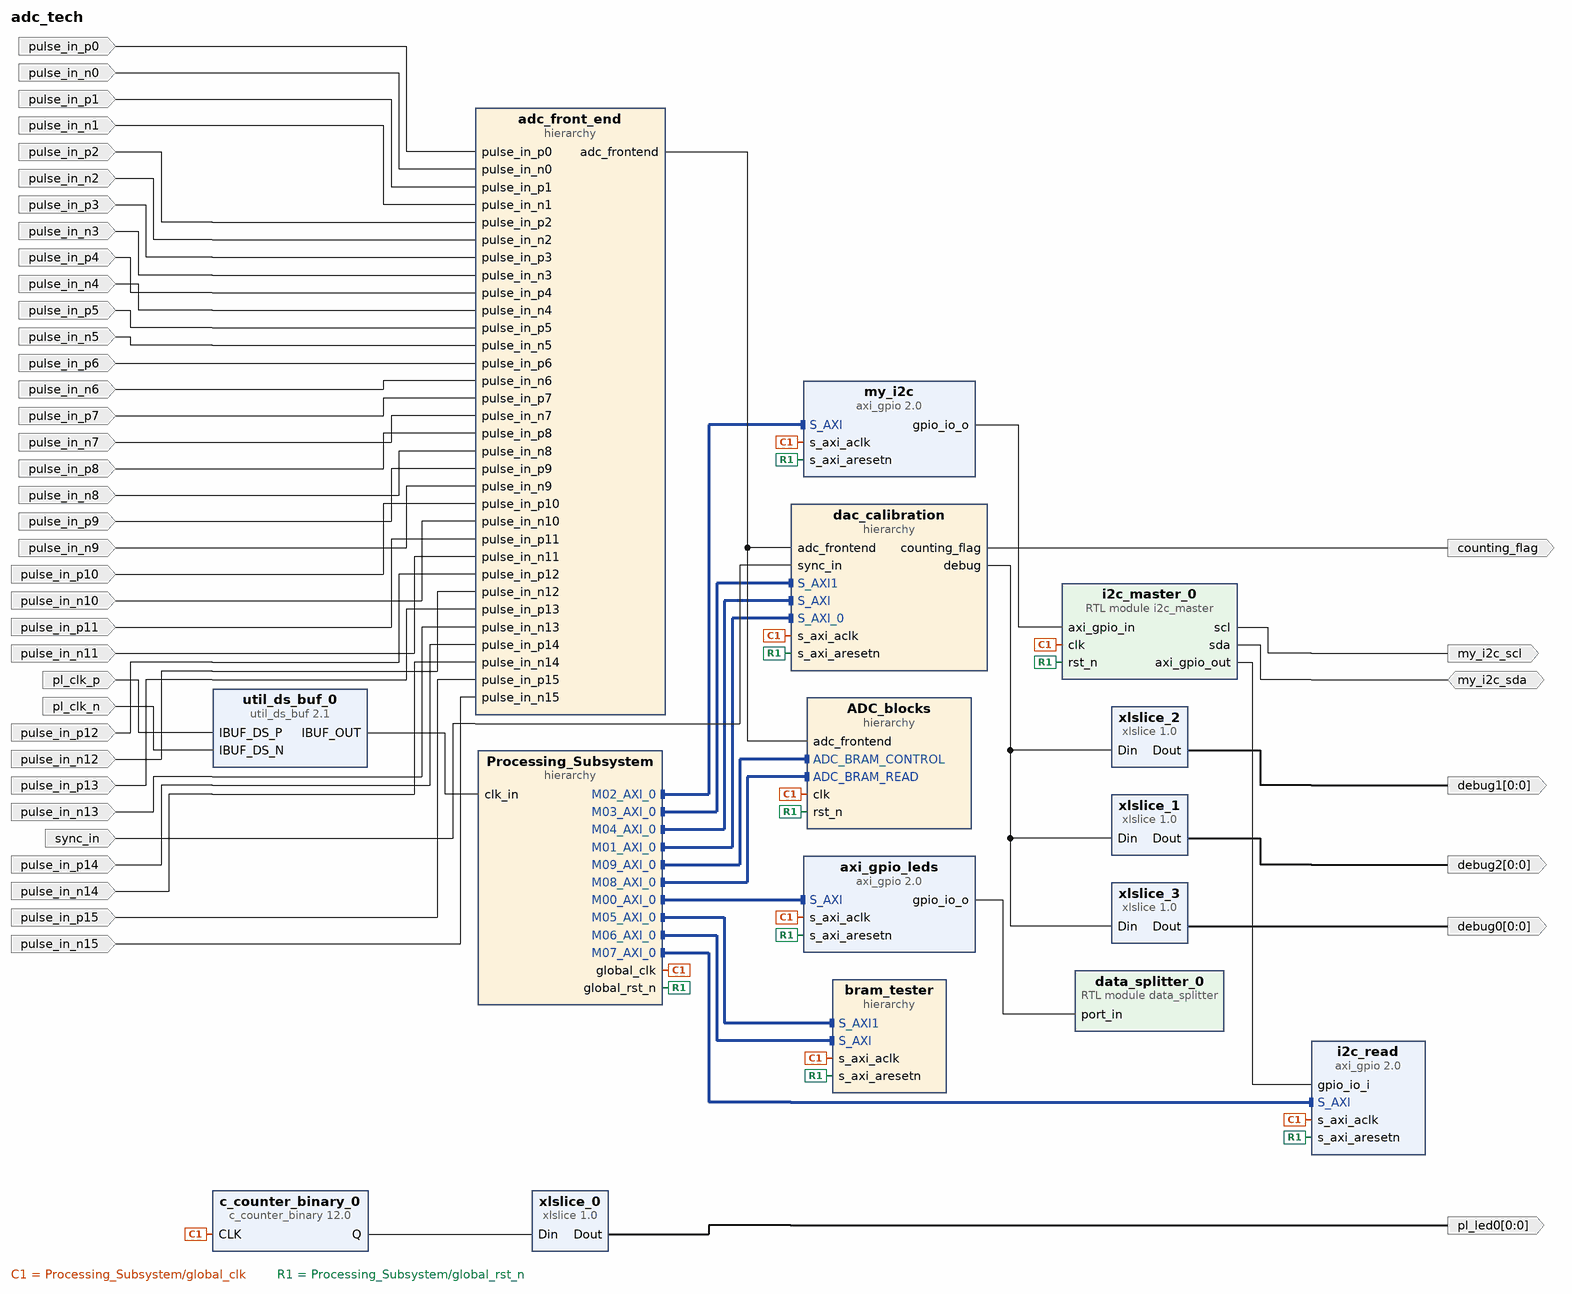
[diagram p0: block diagram of the top level]
# Vivado block design adc_tech, xczu7ev-ffvc1156-2-e, Vivado 2020.2
create_bd_design adc_tech

create_bd_port -dir I -type clk pl_clk_p
set_property -dict {CONFIG.FREQ_HZ 125000000} [get_bd_ports pl_clk_p]
create_bd_port -dir O -from 0 -to 0 pl_led0
create_bd_port -dir I -type clk pl_clk_n
set_property -dict {CONFIG.FREQ_HZ 125000000} [get_bd_ports pl_clk_n]
create_bd_port -dir O my_i2c_scl
create_bd_port -dir IO my_i2c_sda
create_bd_port -dir I pulse_in_p0
create_bd_port -dir I sync_in
create_bd_port -dir O counting_flag
create_bd_port -dir I pulse_in_n0
create_bd_port -dir I pulse_in_n1
create_bd_port -dir I pulse_in_p1
create_bd_port -dir I pulse_in_p2
create_bd_port -dir I pulse_in_n2
create_bd_port -dir I pulse_in_p3
create_bd_port -dir I pulse_in_n3
create_bd_port -dir O -from 0 -to 0 debug0
create_bd_port -dir O -from 0 -to 0 debug1
create_bd_port -dir O -from 0 -to 0 debug2
create_bd_port -dir I pulse_in_p4
create_bd_port -dir I pulse_in_n4
create_bd_port -dir I pulse_in_p5
create_bd_port -dir I pulse_in_n5
create_bd_port -dir I pulse_in_p6
create_bd_port -dir I pulse_in_n6
create_bd_port -dir I pulse_in_p7
create_bd_port -dir I pulse_in_n7
create_bd_port -dir I pulse_in_p8
create_bd_port -dir I pulse_in_n8
create_bd_port -dir I pulse_in_p9
create_bd_port -dir I pulse_in_n9
create_bd_port -dir I pulse_in_p10
create_bd_port -dir I pulse_in_n10
create_bd_port -dir I pulse_in_p11
create_bd_port -dir I pulse_in_n11
create_bd_port -dir I pulse_in_p12
create_bd_port -dir I pulse_in_n12
create_bd_port -dir I pulse_in_p13
create_bd_port -dir I pulse_in_n13
create_bd_port -dir I pulse_in_p14
create_bd_port -dir I pulse_in_n14
create_bd_port -dir I pulse_in_p15
create_bd_port -dir I pulse_in_n15

create_bd_cell -type hier Processing_Subsystem
create_bd_cell -type ip -vlnv xilinx.com:ip:util_ds_buf:2.1 util_ds_buf_0
create_bd_cell -type ip -vlnv xilinx.com:ip:axi_gpio:2.0 axi_gpio_leds
set_property -dict {CONFIG.C_ALL_OUTPUTS 1} [get_bd_cells axi_gpio_leds]
create_bd_cell -type ip -vlnv xilinx.com:ip:axi_gpio:2.0 my_i2c
set_property -dict {CONFIG.C_ALL_OUTPUTS 1} [get_bd_cells my_i2c]
create_bd_cell -type module -reference data_splitter data_splitter_0
create_bd_cell -type ip -vlnv xilinx.com:ip:c_counter_binary:12.0 c_counter_binary_0
set_property -dict {CONFIG.Output_Width 32} [get_bd_cells c_counter_binary_0]
create_bd_cell -type ip -vlnv xilinx.com:ip:xlslice:1.0 xlslice_0
set_property -dict {CONFIG.DIN_FROM 27 CONFIG.DIN_TO 27 CONFIG.DOUT_WIDTH 1} [get_bd_cells xlslice_0]
create_bd_cell -type ip -vlnv xilinx.com:ip:xlslice:1.0 xlslice_1
set_property -dict {CONFIG.DIN_FROM 2 CONFIG.DIN_TO 2 CONFIG.DIN_WIDTH 3 CONFIG.DOUT_WIDTH 1} [get_bd_cells xlslice_1]
create_bd_cell -type ip -vlnv xilinx.com:ip:xlslice:1.0 xlslice_2
set_property -dict {CONFIG.DIN_FROM 1 CONFIG.DIN_TO 1 CONFIG.DIN_WIDTH 3 CONFIG.DOUT_WIDTH 1} [get_bd_cells xlslice_2]
create_bd_cell -type ip -vlnv xilinx.com:ip:xlslice:1.0 xlslice_3
set_property -dict {CONFIG.DIN_WIDTH 3} [get_bd_cells xlslice_3]
create_bd_cell -type hier bram_tester
create_bd_cell -type hier dac_calibration
create_bd_cell -type hier adc_front_end
create_bd_cell -type ip -vlnv xilinx.com:ip:axi_gpio:2.0 i2c_read
set_property -dict {CONFIG.C_ALL_INPUTS 1} [get_bd_cells i2c_read]
create_bd_cell -type module -reference i2c_master i2c_master_0
create_bd_cell -type hier ADC_blocks

# ---- hierarchy /Processing_Subsystem ----
current_bd_instance /Processing_Subsystem
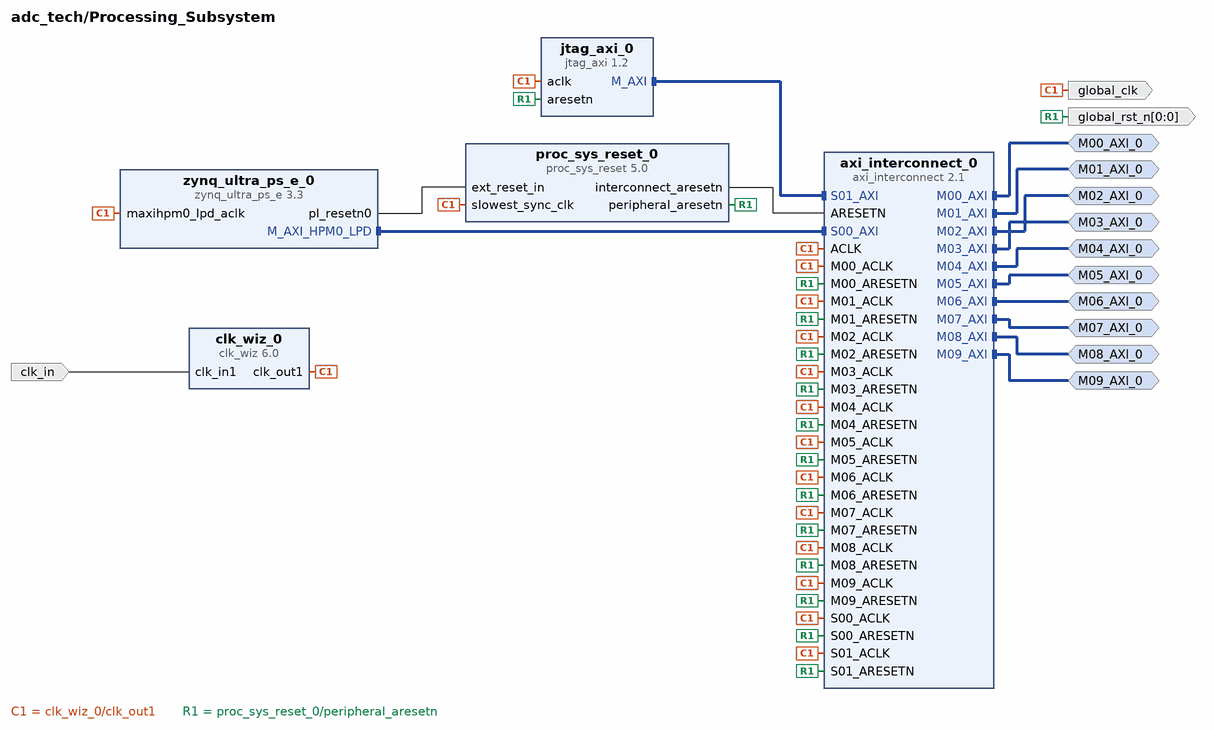
[diagram p1: block diagram inside /Processing_Subsystem]
create_bd_intf_pin -mode Master -vlnv xilinx.com:interface:aximm_rtl:1.0 M00_AXI_0
create_bd_intf_pin -mode Master -vlnv xilinx.com:interface:aximm_rtl:1.0 M01_AXI_0
create_bd_intf_pin -mode Master -vlnv xilinx.com:interface:aximm_rtl:1.0 M02_AXI_0
create_bd_intf_pin -mode Master -vlnv xilinx.com:interface:aximm_rtl:1.0 M03_AXI_0
create_bd_intf_pin -mode Master -vlnv xilinx.com:interface:aximm_rtl:1.0 M04_AXI_0
create_bd_intf_pin -mode Master -vlnv xilinx.com:interface:aximm_rtl:1.0 M05_AXI_0
create_bd_intf_pin -mode Master -vlnv xilinx.com:interface:aximm_rtl:1.0 M06_AXI_0
create_bd_intf_pin -mode Master -vlnv xilinx.com:interface:aximm_rtl:1.0 M07_AXI_0
create_bd_intf_pin -mode Master -vlnv xilinx.com:interface:aximm_rtl:1.0 M08_AXI_0
create_bd_intf_pin -mode Master -vlnv xilinx.com:interface:aximm_rtl:1.0 M09_AXI_0
create_bd_pin -dir I -type clk clk_in
create_bd_pin -dir O -from 0 -to 0 -type rst global_rst_n
create_bd_pin -dir O global_clk

create_bd_cell -type ip -vlnv xilinx.com:ip:axi_interconnect:2.1 axi_interconnect_0
set_property -dict {CONFIG.NUM_MI 10 CONFIG.NUM_SI 2} [get_bd_cells axi_interconnect_0]
create_bd_cell -type ip -vlnv xilinx.com:ip:clk_wiz:6.0 clk_wiz_0
set_property -dict [list \
  CONFIG.CLKIN1_JITTER_PS 80.0 \
  CONFIG.CLKOUT1_JITTER 146.303 \
  CONFIG.CLKOUT1_PHASE_ERROR 222.305 \
  CONFIG.CLKOUT1_REQUESTED_OUT_FREQ 400.000 \
  CONFIG.MMCM_CLKFBOUT_MULT_F 48.000 \
  CONFIG.MMCM_CLKIN1_PERIOD 8.000 \
  CONFIG.MMCM_CLKIN2_PERIOD 10.000 \
  CONFIG.MMCM_CLKOUT0_DIVIDE_F 3.000 \
  CONFIG.USE_RESET false \
] [get_bd_cells clk_wiz_0]
create_bd_cell -type ip -vlnv xilinx.com:ip:jtag_axi:1.2 jtag_axi_0
set_property -dict {CONFIG.RD_TXN_QUEUE_LENGTH 16 CONFIG.WR_TXN_QUEUE_LENGTH 16} [get_bd_cells jtag_axi_0]
create_bd_cell -type ip -vlnv xilinx.com:ip:proc_sys_reset:5.0 proc_sys_reset_0
create_bd_cell -type ip -vlnv xilinx.com:ip:zynq_ultra_ps_e:3.3 zynq_ultra_ps_e_0
set_property -dict [list \
  CONFIG.CAN0_BOARD_INTERFACE custom \
  CONFIG.CAN1_BOARD_INTERFACE custom \
  CONFIG.CSU_BOARD_INTERFACE custom \
  CONFIG.DP_BOARD_INTERFACE custom \
  CONFIG.GEM0_BOARD_INTERFACE custom \
  CONFIG.GEM1_BOARD_INTERFACE custom \
  CONFIG.GEM2_BOARD_INTERFACE custom \
  CONFIG.GEM3_BOARD_INTERFACE custom \
  CONFIG.GPIO_BOARD_INTERFACE custom \
  CONFIG.IIC0_BOARD_INTERFACE custom \
  CONFIG.IIC1_BOARD_INTERFACE custom \
  CONFIG.NAND_BOARD_INTERFACE custom \
  CONFIG.PCIE_BOARD_INTERFACE custom \
  CONFIG.PJTAG_BOARD_INTERFACE custom \
  CONFIG.PMU_BOARD_INTERFACE custom \
  CONFIG.PSU_BANK_0_IO_STANDARD LVCMOS33 \
  CONFIG.PSU_BANK_1_IO_STANDARD LVCMOS33 \
  CONFIG.PSU_BANK_2_IO_STANDARD LVCMOS33 \
  CONFIG.PSU_BANK_3_IO_STANDARD LVCMOS33 \
  CONFIG.PSU_USB3__DUAL_CLOCK_ENABLE 0 \
  CONFIG.PSU__ACPU2__POWER__ON 0 \
  CONFIG.PSU__ACPU3__POWER__ON 0 \
  CONFIG.PSU__CAN1__PERIPHERAL__ENABLE 0 \
  CONFIG.PSU__CRF_APB__ACPU_CTRL__FREQMHZ 1200 \
  CONFIG.PSU__CRF_APB__ACPU_CTRL__SRCSEL APLL \
  CONFIG.PSU__CRF_APB__APLL_CTRL__SRCSEL PSS_REF_CLK \
  CONFIG.PSU__CRF_APB__DBG_FPD_CTRL__FREQMHZ 250 \
  CONFIG.PSU__CRF_APB__DBG_FPD_CTRL__SRCSEL IOPLL \
  CONFIG.PSU__CRF_APB__DBG_TRACE_CTRL__FREQMHZ 250 \
  CONFIG.PSU__CRF_APB__DBG_TRACE_CTRL__SRCSEL IOPLL \
  CONFIG.PSU__CRF_APB__DBG_TSTMP_CTRL__FREQMHZ 250 \
  CONFIG.PSU__CRF_APB__DBG_TSTMP_CTRL__SRCSEL IOPLL \
  CONFIG.PSU__CRF_APB__DDR_CTRL__FREQMHZ 800 \
  CONFIG.PSU__CRF_APB__DDR_CTRL__SRCSEL DPLL \
  CONFIG.PSU__CRF_APB__DPDMA_REF_CTRL__FREQMHZ 600 \
  CONFIG.PSU__CRF_APB__DPDMA_REF_CTRL__SRCSEL DPLL \
  CONFIG.PSU__CRF_APB__DPLL_CTRL__SRCSEL PSS_REF_CLK \
  CONFIG.PSU__CRF_APB__DP_AUDIO_REF_CTRL__SRCSEL VPLL \
  CONFIG.PSU__CRF_APB__DP_STC_REF_CTRL__SRCSEL VPLL \
  CONFIG.PSU__CRF_APB__DP_VIDEO_REF_CTRL__SRCSEL DPLL \
  CONFIG.PSU__CRF_APB__GDMA_REF_CTRL__FREQMHZ 600 \
  CONFIG.PSU__CRF_APB__GDMA_REF_CTRL__SRCSEL DPLL \
  CONFIG.PSU__CRF_APB__GPU_REF_CTRL__FREQMHZ 600 \
  CONFIG.PSU__CRF_APB__GPU_REF_CTRL__SRCSEL DPLL \
  CONFIG.PSU__CRF_APB__TOPSW_LSBUS_CTRL__FREQMHZ 100 \
  CONFIG.PSU__CRF_APB__TOPSW_LSBUS_CTRL__SRCSEL IOPLL \
  CONFIG.PSU__CRF_APB__TOPSW_MAIN_CTRL__FREQMHZ 533.333 \
  CONFIG.PSU__CRF_APB__TOPSW_MAIN_CTRL__SRCSEL VPLL \
  CONFIG.PSU__CRF_APB__VPLL_CTRL__SRCSEL PSS_REF_CLK \
  CONFIG.PSU__CRL_APB__ADMA_REF_CTRL__FREQMHZ 500 \
  CONFIG.PSU__CRL_APB__ADMA_REF_CTRL__SRCSEL IOPLL \
  CONFIG.PSU__CRL_APB__CAN1_REF_CTRL__FREQMHZ 100 \
  CONFIG.PSU__CRL_APB__CAN1_REF_CTRL__SRCSEL IOPLL \
  CONFIG.PSU__CRL_APB__CPU_R5_CTRL__FREQMHZ 500 \
  CONFIG.PSU__CRL_APB__CPU_R5_CTRL__SRCSEL IOPLL \
  CONFIG.PSU__CRL_APB__DBG_LPD_CTRL__FREQMHZ 250 \
  CONFIG.PSU__CRL_APB__DBG_LPD_CTRL__SRCSEL IOPLL \
  CONFIG.PSU__CRL_APB__GEM3_REF_CTRL__FREQMHZ 125 \
  CONFIG.PSU__CRL_APB__GEM3_REF_CTRL__SRCSEL IOPLL \
  CONFIG.PSU__CRL_APB__I2C0_REF_CTRL__FREQMHZ 100 \
  CONFIG.PSU__CRL_APB__I2C0_REF_CTRL__SRCSEL IOPLL \
  CONFIG.PSU__CRL_APB__I2C1_REF_CTRL__FREQMHZ 100 \
  CONFIG.PSU__CRL_APB__I2C1_REF_CTRL__SRCSEL IOPLL \
  CONFIG.PSU__CRL_APB__IOPLL_CTRL__SRCSEL PSS_REF_CLK \
  CONFIG.PSU__CRL_APB__IOU_SWITCH_CTRL__FREQMHZ 267 \
  CONFIG.PSU__CRL_APB__IOU_SWITCH_CTRL__SRCSEL RPLL \
  CONFIG.PSU__CRL_APB__LPD_LSBUS_CTRL__FREQMHZ 100 \
  CONFIG.PSU__CRL_APB__LPD_LSBUS_CTRL__SRCSEL IOPLL \
  CONFIG.PSU__CRL_APB__LPD_SWITCH_CTRL__FREQMHZ 500 \
  CONFIG.PSU__CRL_APB__LPD_SWITCH_CTRL__SRCSEL IOPLL \
  CONFIG.PSU__CRL_APB__PCAP_CTRL__FREQMHZ 200 \
  CONFIG.PSU__CRL_APB__PCAP_CTRL__SRCSEL IOPLL \
  CONFIG.PSU__CRL_APB__PL0_REF_CTRL__FREQMHZ 100 \
  CONFIG.PSU__CRL_APB__PL0_REF_CTRL__SRCSEL RPLL \
  CONFIG.PSU__CRL_APB__QSPI_REF_CTRL__FREQMHZ 300 \
  CONFIG.PSU__CRL_APB__QSPI_REF_CTRL__SRCSEL IOPLL \
  CONFIG.PSU__CRL_APB__RPLL_CTRL__SRCSEL PSS_REF_CLK \
  CONFIG.PSU__CRL_APB__SDIO1_REF_CTRL__FREQMHZ 200 \
  CONFIG.PSU__CRL_APB__SDIO1_REF_CTRL__SRCSEL RPLL \
  CONFIG.PSU__CRL_APB__TIMESTAMP_REF_CTRL__FREQMHZ 100 \
  CONFIG.PSU__CRL_APB__TIMESTAMP_REF_CTRL__SRCSEL PSS_REF_CLK \
  CONFIG.PSU__CRL_APB__UART0_REF_CTRL__FREQMHZ 100 \
  CONFIG.PSU__CRL_APB__UART0_REF_CTRL__SRCSEL IOPLL \
  CONFIG.PSU__CRL_APB__UART1_REF_CTRL__FREQMHZ 100 \
  CONFIG.PSU__CRL_APB__UART1_REF_CTRL__SRCSEL IOPLL \
  CONFIG.PSU__CRL_APB__USB0_BUS_REF_CTRL__FREQMHZ 250 \
  CONFIG.PSU__CRL_APB__USB0_BUS_REF_CTRL__SRCSEL IOPLL \
  CONFIG.PSU__CRL_APB__USB3_DUAL_REF_CTRL__FREQMHZ 20 \
  CONFIG.PSU__CRL_APB__USB3_DUAL_REF_CTRL__SRCSEL IOPLL \
  CONFIG.PSU__CRL_APB__USB3__ENABLE 0 \
  CONFIG.PSU__CSUPMU__PERIPHERAL__VALID 0 \
  CONFIG.PSU__DDRC__BUS_WIDTH {64 Bit} \
  CONFIG.PSU__DDRC__COMPONENTS Components \
  CONFIG.PSU__DDRC__DEVICE_CAPACITY {2048 MBits} \
  CONFIG.PSU__DDRC__DRAM_WIDTH {8 Bits} \
  CONFIG.PSU__DDRC__ECC Disabled \
  CONFIG.PSU__DDRC__MEMORY_TYPE {DDR 4} \
  CONFIG.PSU__DDRC__SPEED_BIN DDR4_1600J \
  CONFIG.PSU__DDR_HIGH_ADDRESS_GUI_ENABLE 0 \
  CONFIG.PSU__DDR__INTERFACE__FREQMHZ 400.000 \
  CONFIG.PSU__DEVICE_TYPE EV \
  CONFIG.PSU__DISPLAYPORT__PERIPHERAL__ENABLE 0 \
  CONFIG.PSU__DLL__ISUSED 0 \
  CONFIG.PSU__ENET3__PERIPHERAL__ENABLE 0 \
  CONFIG.PSU__FPD_SLCR__WDT1__FREQMHZ 100 \
  CONFIG.PSU__FPGA_PL0_ENABLE 1 \
  CONFIG.PSU__GPIO0_MIO__PERIPHERAL__ENABLE 0 \
  CONFIG.PSU__GPIO1_MIO__PERIPHERAL__ENABLE 0 \
  CONFIG.PSU__GPU_PP0__POWER__ON 0 \
  CONFIG.PSU__GPU_PP1__POWER__ON 0 \
  CONFIG.PSU__I2C0__PERIPHERAL__ENABLE 0 \
  CONFIG.PSU__I2C1__PERIPHERAL__ENABLE 0 \
  CONFIG.PSU__IOU_SLCR__IOU_TTC_APB_CLK__TTC0_SEL APB \
  CONFIG.PSU__IOU_SLCR__IOU_TTC_APB_CLK__TTC1_SEL APB \
  CONFIG.PSU__IOU_SLCR__IOU_TTC_APB_CLK__TTC2_SEL APB \
  CONFIG.PSU__IOU_SLCR__IOU_TTC_APB_CLK__TTC3_SEL APB \
  CONFIG.PSU__IOU_SLCR__TTC0__FREQMHZ 100 \
  CONFIG.PSU__IOU_SLCR__TTC1__FREQMHZ 100 \
  CONFIG.PSU__IOU_SLCR__TTC2__FREQMHZ 100 \
  CONFIG.PSU__IOU_SLCR__TTC3__FREQMHZ 100 \
  CONFIG.PSU__IOU_SLCR__WDT0__FREQMHZ 100 \
  CONFIG.PSU__LPD_SLCR__CSUPMU__FREQMHZ 100 \
  CONFIG.PSU__OVERRIDE_HPX_QOS 0 \
  CONFIG.PSU__OVERRIDE__BASIC_CLOCK 0 \
  CONFIG.PSU__PJTAG__PERIPHERAL__ENABLE 1 \
  CONFIG.PSU__PJTAG__PERIPHERAL__IO {MIO 0 .. 3} \
  CONFIG.PSU__PMU__PERIPHERAL__ENABLE 0 \
  CONFIG.PSU__PRESET_APPLIED 0 \
  CONFIG.PSU__PSS_REF_CLK__FREQMHZ 33.333 \
  CONFIG.PSU__QSPI__PERIPHERAL__ENABLE 0 \
  CONFIG.PSU__SATA__PERIPHERAL__ENABLE 0 \
  CONFIG.PSU__SD1__PERIPHERAL__ENABLE 0 \
  CONFIG.PSU__SWDT0__PERIPHERAL__ENABLE 0 \
  CONFIG.PSU__SWDT1__PERIPHERAL__ENABLE 0 \
  CONFIG.PSU__TTC0__PERIPHERAL__ENABLE 0 \
  CONFIG.PSU__TTC1__PERIPHERAL__ENABLE 0 \
  CONFIG.PSU__TTC2__PERIPHERAL__ENABLE 0 \
  CONFIG.PSU__TTC3__PERIPHERAL__ENABLE 0 \
  CONFIG.PSU__UART0__PERIPHERAL__ENABLE 0 \
  CONFIG.PSU__UART1__PERIPHERAL__ENABLE 0 \
  CONFIG.PSU__USB0__PERIPHERAL__ENABLE 0 \
  CONFIG.PSU__USE__IRQ0 0 \
  CONFIG.PSU__USE__M_AXI_GP0 0 \
  CONFIG.PSU__USE__M_AXI_GP1 0 \
  CONFIG.PSU__USE__M_AXI_GP2 1 \
  CONFIG.QSPI_BOARD_INTERFACE custom \
  CONFIG.SATA_BOARD_INTERFACE custom \
  CONFIG.SD0_BOARD_INTERFACE custom \
  CONFIG.SD1_BOARD_INTERFACE custom \
  CONFIG.SPI0_BOARD_INTERFACE custom \
  CONFIG.SPI1_BOARD_INTERFACE custom \
  CONFIG.SUBPRESET2 Custom \
  CONFIG.SWDT0_BOARD_INTERFACE custom \
  CONFIG.SWDT1_BOARD_INTERFACE custom \
  CONFIG.TRACE_BOARD_INTERFACE custom \
  CONFIG.TTC0_BOARD_INTERFACE custom \
  CONFIG.TTC1_BOARD_INTERFACE custom \
  CONFIG.TTC2_BOARD_INTERFACE custom \
  CONFIG.TTC3_BOARD_INTERFACE custom \
  CONFIG.UART0_BOARD_INTERFACE custom \
  CONFIG.UART1_BOARD_INTERFACE custom \
  CONFIG.USB0_BOARD_INTERFACE custom \
  CONFIG.USB1_BOARD_INTERFACE custom \
] [get_bd_cells zynq_ultra_ps_e_0]
# 736 more settings of zynq_ultra_ps_e_0 are not shown: defaults, MIO pin electricals, DDR timing, and values the tool derives

# ---- hierarchy /bram_tester ----
current_bd_instance /bram_tester
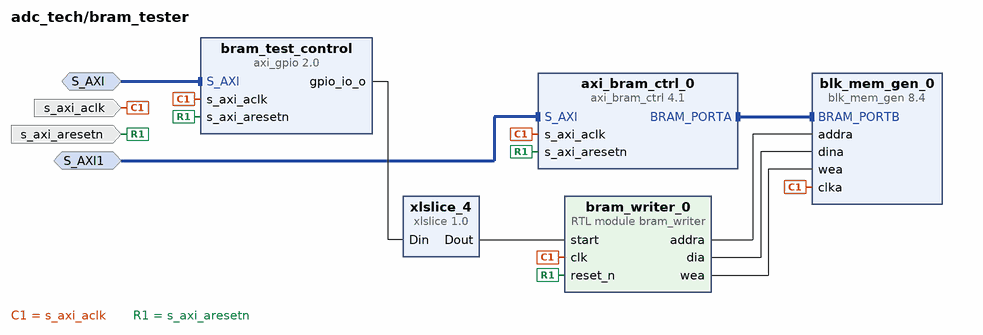
[diagram p2: block diagram inside /bram_tester]
create_bd_intf_pin -mode Slave -vlnv xilinx.com:interface:aximm_rtl:1.0 S_AXI
create_bd_intf_pin -mode Slave -vlnv xilinx.com:interface:aximm_rtl:1.0 S_AXI1
create_bd_pin -dir I -type clk s_axi_aclk
create_bd_pin -dir I -type rst s_axi_aresetn

create_bd_cell -type ip -vlnv xilinx.com:ip:axi_gpio:2.0 bram_test_control
set_property -dict {CONFIG.C_ALL_OUTPUTS 1} [get_bd_cells bram_test_control]
create_bd_cell -type ip -vlnv xilinx.com:ip:axi_bram_ctrl:4.1 axi_bram_ctrl_0
set_property -dict {CONFIG.SINGLE_PORT_BRAM 1} [get_bd_cells axi_bram_ctrl_0]
create_bd_cell -type ip -vlnv xilinx.com:ip:blk_mem_gen:8.4 blk_mem_gen_0
set_property -dict [list \
  CONFIG.Enable_32bit_Address false \
  CONFIG.Enable_A Always_Enabled \
  CONFIG.Enable_B Always_Enabled \
  CONFIG.Load_Init_File false \
  CONFIG.Memory_Type Simple_Dual_Port_RAM \
  CONFIG.Operating_Mode_A NO_CHANGE \
  CONFIG.Port_B_Clock 100 \
  CONFIG.Port_B_Enable_Rate 100 \
  CONFIG.Register_PortB_Output_of_Memory_Primitives true \
  CONFIG.Use_Byte_Write_Enable false \
  CONFIG.use_bram_block Stand_Alone \
] [get_bd_cells blk_mem_gen_0]
create_bd_cell -type ip -vlnv xilinx.com:ip:xlslice:1.0 xlslice_4
create_bd_cell -type module -reference bram_writer bram_writer_0

# ---- hierarchy /dac_calibration ----
current_bd_instance /dac_calibration
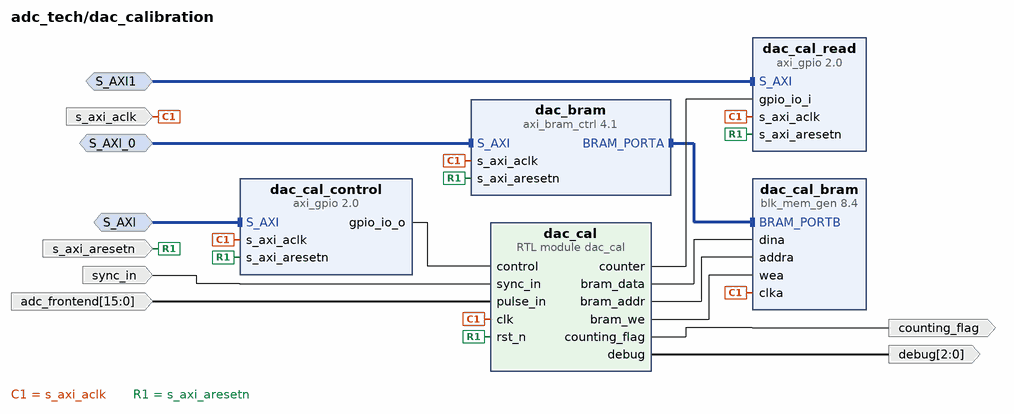
[diagram p3: block diagram inside /dac_calibration]
create_bd_intf_pin -mode Slave -vlnv xilinx.com:interface:aximm_rtl:1.0 S_AXI
create_bd_intf_pin -mode Slave -vlnv xilinx.com:interface:aximm_rtl:1.0 S_AXI1
create_bd_intf_pin -mode Slave -vlnv xilinx.com:interface:aximm_rtl:1.0 S_AXI_0
create_bd_pin -dir I -type clk s_axi_aclk
create_bd_pin -dir I -type rst s_axi_aresetn
create_bd_pin -dir I sync_in
create_bd_pin -dir O counting_flag
create_bd_pin -dir O -from 2 -to 0 debug
create_bd_pin -dir I -from 15 -to 0 adc_frontend

create_bd_cell -type ip -vlnv xilinx.com:ip:axi_gpio:2.0 dac_cal_control
set_property -dict {CONFIG.C_ALL_OUTPUTS 1} [get_bd_cells dac_cal_control]
create_bd_cell -type ip -vlnv xilinx.com:ip:blk_mem_gen:8.4 dac_cal_bram
set_property -dict [list \
  CONFIG.Enable_32bit_Address false \
  CONFIG.Enable_A Always_Enabled \
  CONFIG.Enable_B Always_Enabled \
  CONFIG.Load_Init_File false \
  CONFIG.Memory_Type Simple_Dual_Port_RAM \
  CONFIG.Operating_Mode_A NO_CHANGE \
  CONFIG.Port_B_Clock 100 \
  CONFIG.Port_B_Enable_Rate 100 \
  CONFIG.Register_PortB_Output_of_Memory_Primitives true \
  CONFIG.Use_Byte_Write_Enable false \
  CONFIG.Write_Depth_A 65536 \
  CONFIG.use_bram_block Stand_Alone \
] [get_bd_cells dac_cal_bram]
create_bd_cell -type ip -vlnv xilinx.com:ip:axi_gpio:2.0 dac_cal_read
set_property -dict {CONFIG.C_ALL_INPUTS 1} [get_bd_cells dac_cal_read]
create_bd_cell -type ip -vlnv xilinx.com:ip:axi_bram_ctrl:4.1 dac_bram
set_property -dict {CONFIG.SINGLE_PORT_BRAM 1} [get_bd_cells dac_bram]
create_bd_cell -type module -reference dac_cal dac_cal

# ---- hierarchy /adc_front_end ----
current_bd_instance /adc_front_end
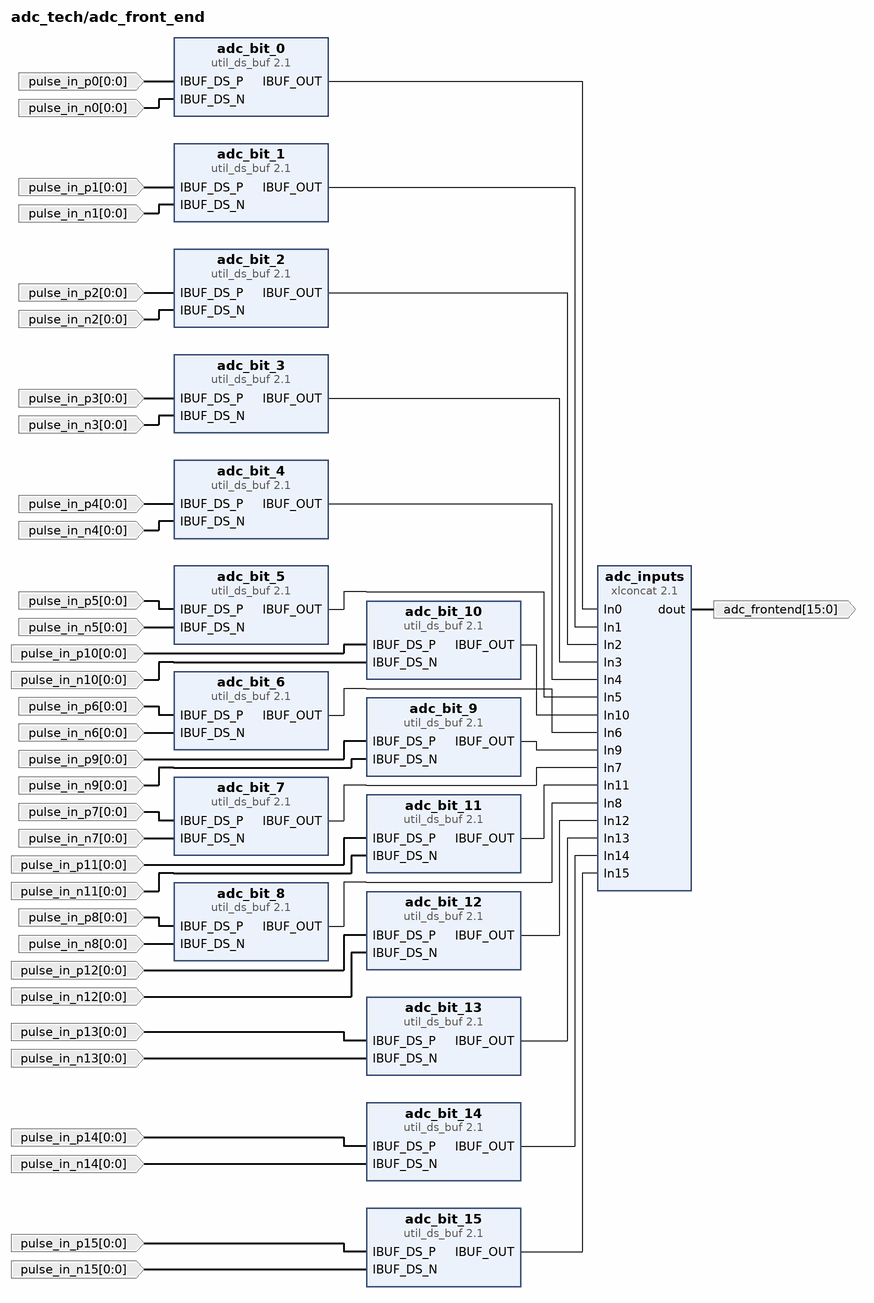
[diagram p4: block diagram inside /adc_front_end]
create_bd_pin -dir I -from 0 -to 0 pulse_in_p2
create_bd_pin -dir I -from 0 -to 0 pulse_in_n2
create_bd_pin -dir I -from 0 -to 0 pulse_in_p3
create_bd_pin -dir I -from 0 -to 0 pulse_in_n3
create_bd_pin -dir I -from 0 -to 0 pulse_in_p4
create_bd_pin -dir I -from 0 -to 0 pulse_in_n4
create_bd_pin -dir I -from 0 -to 0 pulse_in_p5
create_bd_pin -dir I -from 0 -to 0 pulse_in_n5
create_bd_pin -dir I -from 0 -to 0 pulse_in_p6
create_bd_pin -dir I -from 0 -to 0 pulse_in_n6
create_bd_pin -dir I -from 0 -to 0 pulse_in_p7
create_bd_pin -dir I -from 0 -to 0 pulse_in_n7
create_bd_pin -dir I -from 0 -to 0 pulse_in_p8
create_bd_pin -dir I -from 0 -to 0 pulse_in_n8
create_bd_pin -dir I -from 0 -to 0 pulse_in_p10
create_bd_pin -dir I -from 0 -to 0 pulse_in_n10
create_bd_pin -dir I -from 0 -to 0 pulse_in_p11
create_bd_pin -dir I -from 0 -to 0 pulse_in_n11
create_bd_pin -dir I -from 0 -to 0 pulse_in_p9
create_bd_pin -dir I -from 0 -to 0 pulse_in_n9
create_bd_pin -dir I -from 0 -to 0 pulse_in_p12
create_bd_pin -dir I -from 0 -to 0 pulse_in_n12
create_bd_pin -dir I -from 0 -to 0 pulse_in_p13
create_bd_pin -dir I -from 0 -to 0 pulse_in_n13
create_bd_pin -dir I -from 0 -to 0 pulse_in_p14
create_bd_pin -dir I -from 0 -to 0 pulse_in_n14
create_bd_pin -dir I -from 0 -to 0 pulse_in_p15
create_bd_pin -dir I -from 0 -to 0 pulse_in_n15
create_bd_pin -dir I -from 0 -to 0 pulse_in_p0
create_bd_pin -dir I -from 0 -to 0 pulse_in_n0
create_bd_pin -dir I -from 0 -to 0 pulse_in_p1
create_bd_pin -dir I -from 0 -to 0 pulse_in_n1
create_bd_pin -dir O -from 15 -to 0 adc_frontend

create_bd_cell -type ip -vlnv xilinx.com:ip:util_ds_buf:2.1 adc_bit_2
set_property -dict {CONFIG.C_BUF_TYPE IBUFDS} [get_bd_cells adc_bit_2]
create_bd_cell -type ip -vlnv xilinx.com:ip:util_ds_buf:2.1 adc_bit_3
set_property -dict {CONFIG.C_BUF_TYPE IBUFDS} [get_bd_cells adc_bit_3]
create_bd_cell -type ip -vlnv xilinx.com:ip:util_ds_buf:2.1 adc_bit_4
set_property -dict {CONFIG.C_BUF_TYPE IBUFDS} [get_bd_cells adc_bit_4]
create_bd_cell -type ip -vlnv xilinx.com:ip:util_ds_buf:2.1 adc_bit_5
set_property -dict {CONFIG.C_BUF_TYPE IBUFDS} [get_bd_cells adc_bit_5]
create_bd_cell -type ip -vlnv xilinx.com:ip:util_ds_buf:2.1 adc_bit_6
set_property -dict {CONFIG.C_BUF_TYPE IBUFDS} [get_bd_cells adc_bit_6]
create_bd_cell -type ip -vlnv xilinx.com:ip:util_ds_buf:2.1 adc_bit_7
set_property -dict {CONFIG.C_BUF_TYPE IBUFDS} [get_bd_cells adc_bit_7]
create_bd_cell -type ip -vlnv xilinx.com:ip:util_ds_buf:2.1 adc_bit_8
set_property -dict {CONFIG.C_BUF_TYPE IBUFDS} [get_bd_cells adc_bit_8]
create_bd_cell -type ip -vlnv xilinx.com:ip:util_ds_buf:2.1 adc_bit_10
set_property -dict {CONFIG.C_BUF_TYPE IBUFDS} [get_bd_cells adc_bit_10]
create_bd_cell -type ip -vlnv xilinx.com:ip:util_ds_buf:2.1 adc_bit_11
set_property -dict {CONFIG.C_BUF_TYPE IBUFDS} [get_bd_cells adc_bit_11]
create_bd_cell -type ip -vlnv xilinx.com:ip:util_ds_buf:2.1 adc_bit_9
set_property -dict {CONFIG.C_BUF_TYPE IBUFDS} [get_bd_cells adc_bit_9]
create_bd_cell -type ip -vlnv xilinx.com:ip:util_ds_buf:2.1 adc_bit_12
set_property -dict {CONFIG.C_BUF_TYPE IBUFDS} [get_bd_cells adc_bit_12]
create_bd_cell -type ip -vlnv xilinx.com:ip:util_ds_buf:2.1 adc_bit_13
set_property -dict {CONFIG.C_BUF_TYPE IBUFDS} [get_bd_cells adc_bit_13]
create_bd_cell -type ip -vlnv xilinx.com:ip:util_ds_buf:2.1 adc_bit_14
set_property -dict {CONFIG.C_BUF_TYPE IBUFDS} [get_bd_cells adc_bit_14]
create_bd_cell -type ip -vlnv xilinx.com:ip:util_ds_buf:2.1 adc_bit_15
set_property -dict {CONFIG.C_BUF_TYPE IBUFDS} [get_bd_cells adc_bit_15]
create_bd_cell -type ip -vlnv xilinx.com:ip:util_ds_buf:2.1 adc_bit_0
set_property -dict {CONFIG.C_BUF_TYPE IBUFDS} [get_bd_cells adc_bit_0]
create_bd_cell -type ip -vlnv xilinx.com:ip:util_ds_buf:2.1 adc_bit_1
set_property -dict {CONFIG.C_BUF_TYPE IBUFDS} [get_bd_cells adc_bit_1]
create_bd_cell -type ip -vlnv xilinx.com:ip:xlconcat:2.1 adc_inputs
set_property -dict {CONFIG.NUM_PORTS 16} [get_bd_cells adc_inputs]

# ---- hierarchy /ADC_blocks ----
current_bd_instance /ADC_blocks
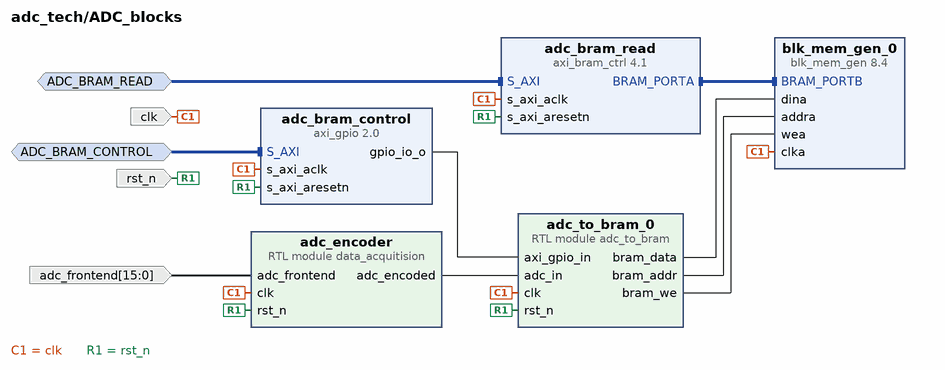
[diagram p5: block diagram inside /ADC_blocks]
create_bd_intf_pin -mode Slave -vlnv xilinx.com:interface:aximm_rtl:1.0 ADC_BRAM_READ
create_bd_intf_pin -mode Slave -vlnv xilinx.com:interface:aximm_rtl:1.0 ADC_BRAM_CONTROL
create_bd_pin -dir I -from 15 -to 0 adc_frontend
create_bd_pin -dir I clk
create_bd_pin -dir I rst_n

create_bd_cell -type ip -vlnv xilinx.com:ip:blk_mem_gen:8.4 blk_mem_gen_0
set_property -dict [list \
  CONFIG.Enable_32bit_Address false \
  CONFIG.Enable_A Always_Enabled \
  CONFIG.Enable_B Always_Enabled \
  CONFIG.Memory_Type Simple_Dual_Port_RAM \
  CONFIG.Operating_Mode_A NO_CHANGE \
  CONFIG.Port_B_Clock 100 \
  CONFIG.Port_B_Enable_Rate 100 \
  CONFIG.Register_PortB_Output_of_Memory_Primitives true \
  CONFIG.Use_Byte_Write_Enable false \
  CONFIG.Write_Depth_A 65536 \
  CONFIG.use_bram_block Stand_Alone \
] [get_bd_cells blk_mem_gen_0]
create_bd_cell -type module -reference data_acquitision adc_encoder
create_bd_cell -type ip -vlnv xilinx.com:ip:axi_bram_ctrl:4.1 adc_bram_read
set_property -dict {CONFIG.SINGLE_PORT_BRAM 1} [get_bd_cells adc_bram_read]
create_bd_cell -type module -reference adc_to_bram adc_to_bram_0
create_bd_cell -type ip -vlnv xilinx.com:ip:axi_gpio:2.0 adc_bram_control
set_property -dict {CONFIG.C_ALL_OUTPUTS 1} [get_bd_cells adc_bram_control]

# ---- connections ----

current_bd_instance /Processing_Subsystem
connect_bd_intf_net [get_bd_intf_pins M05_AXI_0] [get_bd_intf_pins axi_interconnect_0/M05_AXI]
connect_bd_intf_net [get_bd_intf_pins jtag_axi_0/M_AXI] [get_bd_intf_pins axi_interconnect_0/S01_AXI]
connect_bd_intf_net [get_bd_intf_pins M07_AXI_0] [get_bd_intf_pins axi_interconnect_0/M07_AXI]
connect_bd_intf_net [get_bd_intf_pins M04_AXI_0] [get_bd_intf_pins axi_interconnect_0/M04_AXI]
connect_bd_intf_net [get_bd_intf_pins M06_AXI_0] [get_bd_intf_pins axi_interconnect_0/M06_AXI]
connect_bd_intf_net [get_bd_intf_pins M00_AXI_0] [get_bd_intf_pins axi_interconnect_0/M00_AXI]
connect_bd_intf_net [get_bd_intf_pins M01_AXI_0] [get_bd_intf_pins axi_interconnect_0/M01_AXI]
connect_bd_intf_net [get_bd_intf_pins M03_AXI_0] [get_bd_intf_pins axi_interconnect_0/M03_AXI]
connect_bd_intf_net [get_bd_intf_pins zynq_ultra_ps_e_0/M_AXI_HPM0_LPD] [get_bd_intf_pins axi_interconnect_0/S00_AXI]
connect_bd_intf_net [get_bd_intf_pins M02_AXI_0] [get_bd_intf_pins axi_interconnect_0/M02_AXI]
connect_bd_intf_net [get_bd_intf_pins M08_AXI_0] [get_bd_intf_pins axi_interconnect_0/M08_AXI]
connect_bd_intf_net [get_bd_intf_pins M09_AXI_0] [get_bd_intf_pins axi_interconnect_0/M09_AXI]
connect_bd_net [get_bd_pins zynq_ultra_ps_e_0/pl_resetn0] [get_bd_pins proc_sys_reset_0/ext_reset_in]
connect_bd_net [get_bd_pins clk_in] [get_bd_pins clk_wiz_0/clk_in1]
connect_bd_net [get_bd_pins clk_wiz_0/clk_out1] \
  [get_bd_pins global_clk] [get_bd_pins axi_interconnect_0/ACLK] [get_bd_pins axi_interconnect_0/S00_ACLK] \
  [get_bd_pins axi_interconnect_0/M00_ACLK] [get_bd_pins axi_interconnect_0/M01_ACLK] \
  [get_bd_pins axi_interconnect_0/S01_ACLK] [get_bd_pins jtag_axi_0/aclk] [get_bd_pins proc_sys_reset_0/slowest_sync_clk] \
  [get_bd_pins zynq_ultra_ps_e_0/maxihpm0_lpd_aclk] [get_bd_pins axi_interconnect_0/M02_ACLK] \
  [get_bd_pins axi_interconnect_0/M03_ACLK] [get_bd_pins axi_interconnect_0/M04_ACLK] \
  [get_bd_pins axi_interconnect_0/M05_ACLK] [get_bd_pins axi_interconnect_0/M06_ACLK] \
  [get_bd_pins axi_interconnect_0/M07_ACLK] [get_bd_pins axi_interconnect_0/M09_ACLK] \
  [get_bd_pins axi_interconnect_0/M08_ACLK]
connect_bd_net [get_bd_pins proc_sys_reset_0/peripheral_aresetn] \
  [get_bd_pins global_rst_n] [get_bd_pins axi_interconnect_0/S00_ARESETN] [get_bd_pins axi_interconnect_0/M00_ARESETN] \
  [get_bd_pins axi_interconnect_0/M01_ARESETN] [get_bd_pins axi_interconnect_0/S01_ARESETN] [get_bd_pins jtag_axi_0/aresetn] \
  [get_bd_pins axi_interconnect_0/M02_ARESETN] [get_bd_pins axi_interconnect_0/M03_ARESETN] \
  [get_bd_pins axi_interconnect_0/M04_ARESETN] [get_bd_pins axi_interconnect_0/M05_ARESETN] \
  [get_bd_pins axi_interconnect_0/M06_ARESETN] [get_bd_pins axi_interconnect_0/M07_ARESETN] \
  [get_bd_pins axi_interconnect_0/M08_ARESETN] [get_bd_pins axi_interconnect_0/M09_ARESETN]
connect_bd_net [get_bd_pins proc_sys_reset_0/interconnect_aresetn] [get_bd_pins axi_interconnect_0/ARESETN]

current_bd_instance /bram_tester
connect_bd_intf_net -intf_net Processing_Subsystem_M05_AXI_0 [get_bd_intf_pins S_AXI1] [get_bd_intf_pins axi_bram_ctrl_0/S_AXI]
connect_bd_intf_net -intf_net Processing_Subsystem_M06_AXI_0 [get_bd_intf_pins S_AXI] [get_bd_intf_pins bram_test_control/S_AXI]
connect_bd_intf_net -intf_net axi_bram_ctrl_0_BRAM_PORTA [get_bd_intf_pins axi_bram_ctrl_0/BRAM_PORTA] [get_bd_intf_pins blk_mem_gen_0/BRAM_PORTB]
connect_bd_net [get_bd_pins bram_test_control/gpio_io_o] [get_bd_pins xlslice_4/Din]
connect_bd_net -net xlslice_4_Dout [get_bd_pins xlslice_4/Dout] [get_bd_pins bram_writer_0/start]
connect_bd_net -net bram_writer_0_addra [get_bd_pins bram_writer_0/addra] [get_bd_pins blk_mem_gen_0/addra]
connect_bd_net -net bram_writer_0_dia [get_bd_pins bram_writer_0/dia] [get_bd_pins blk_mem_gen_0/dina]
connect_bd_net -net bram_writer_0_wea [get_bd_pins bram_writer_0/wea] [get_bd_pins blk_mem_gen_0/wea]
connect_bd_net -net Processing_Subsystem_global_clk [get_bd_pins s_axi_aclk] \
  [get_bd_pins axi_bram_ctrl_0/s_axi_aclk] [get_bd_pins blk_mem_gen_0/clka] [get_bd_pins bram_test_control/s_axi_aclk] \
  [get_bd_pins bram_writer_0/clk]
connect_bd_net -net Processing_Subsystem_global_rst_n [get_bd_pins s_axi_aresetn] \
  [get_bd_pins axi_bram_ctrl_0/s_axi_aresetn] [get_bd_pins bram_test_control/s_axi_aresetn] \
  [get_bd_pins bram_writer_0/reset_n]
set_property HDL_ATTRIBUTE.DEBUG true [get_bd_intf_nets axi_bram_ctrl_0_BRAM_PORTA]
set_property HDL_ATTRIBUTE.MARK_DEBUG true [get_bd_intf_nets axi_bram_ctrl_0_BRAM_PORTA]
set_property HDL_ATTRIBUTE.DEBUG true [get_bd_nets xlslice_4_Dout]
set_property HDL_ATTRIBUTE.MARK_DEBUG true [get_bd_nets xlslice_4_Dout]
set_property HDL_ATTRIBUTE.DEBUG true [get_bd_nets bram_writer_0_addra]
set_property HDL_ATTRIBUTE.MARK_DEBUG true [get_bd_nets bram_writer_0_addra]
set_property HDL_ATTRIBUTE.DEBUG true [get_bd_nets bram_writer_0_dia]
set_property HDL_ATTRIBUTE.MARK_DEBUG true [get_bd_nets bram_writer_0_dia]
set_property HDL_ATTRIBUTE.DEBUG true [get_bd_nets bram_writer_0_wea]
set_property HDL_ATTRIBUTE.MARK_DEBUG true [get_bd_nets bram_writer_0_wea]

current_bd_instance /dac_calibration
connect_bd_intf_net [get_bd_intf_pins S_AXI1] [get_bd_intf_pins dac_cal_read/S_AXI]
connect_bd_intf_net [get_bd_intf_pins S_AXI_0] [get_bd_intf_pins dac_bram/S_AXI]
connect_bd_intf_net -intf_net Processing_Subsystem_M04_AXI_0 [get_bd_intf_pins S_AXI] [get_bd_intf_pins dac_cal_control/S_AXI]
connect_bd_intf_net -intf_net axi_bram_ctrl_0_BRAM_PORTA [get_bd_intf_pins dac_bram/BRAM_PORTA] [get_bd_intf_pins dac_cal_bram/BRAM_PORTB]
connect_bd_net [get_bd_pins dac_cal_control/gpio_io_o] [get_bd_pins dac_cal/control]
connect_bd_net -net Processing_Subsystem_global_clk [get_bd_pins s_axi_aclk] \
  [get_bd_pins dac_cal_control/s_axi_aclk] [get_bd_pins dac_cal_bram/clka] [get_bd_pins dac_cal_read/s_axi_aclk] \
  [get_bd_pins dac_bram/s_axi_aclk] [get_bd_pins dac_cal/clk]
connect_bd_net -net Processing_Subsystem_global_rst_n [get_bd_pins s_axi_aresetn] \
  [get_bd_pins dac_cal_control/s_axi_aresetn] [get_bd_pins dac_cal_read/s_axi_aresetn] [get_bd_pins dac_bram/s_axi_aresetn] \
  [get_bd_pins dac_cal/rst_n]
connect_bd_net -net sync_in_0_1 [get_bd_pins sync_in] [get_bd_pins dac_cal/sync_in]
connect_bd_net -net dac_cal_0_counting_flag [get_bd_pins dac_cal/counting_flag] [get_bd_pins counting_flag]
connect_bd_net [get_bd_pins dac_cal/debug] [get_bd_pins debug]
connect_bd_net [get_bd_pins dac_cal/counter] [get_bd_pins dac_cal_read/gpio_io_i]
connect_bd_net [get_bd_pins dac_cal/bram_data] [get_bd_pins dac_cal_bram/dina]
connect_bd_net [get_bd_pins dac_cal/bram_addr] [get_bd_pins dac_cal_bram/addra]
connect_bd_net [get_bd_pins dac_cal/bram_we] [get_bd_pins dac_cal_bram/wea]
connect_bd_net [get_bd_pins adc_frontend] [get_bd_pins dac_cal/pulse_in]

current_bd_instance /adc_front_end
connect_bd_net [get_bd_pins adc_bit_2/IBUF_OUT] [get_bd_pins adc_inputs/In2]
connect_bd_net [get_bd_pins adc_bit_3/IBUF_OUT] [get_bd_pins adc_inputs/In3]
connect_bd_net [get_bd_pins adc_bit_4/IBUF_OUT] [get_bd_pins adc_inputs/In4]
connect_bd_net [get_bd_pins adc_bit_5/IBUF_OUT] [get_bd_pins adc_inputs/In5]
connect_bd_net [get_bd_pins adc_bit_6/IBUF_OUT] [get_bd_pins adc_inputs/In6]
connect_bd_net [get_bd_pins adc_bit_7/IBUF_OUT] [get_bd_pins adc_inputs/In7]
connect_bd_net [get_bd_pins adc_bit_8/IBUF_OUT] [get_bd_pins adc_inputs/In8]
connect_bd_net [get_bd_pins adc_bit_10/IBUF_OUT] [get_bd_pins adc_inputs/In10]
connect_bd_net [get_bd_pins adc_bit_11/IBUF_OUT] [get_bd_pins adc_inputs/In11]
connect_bd_net [get_bd_pins adc_bit_9/IBUF_OUT] [get_bd_pins adc_inputs/In9]
connect_bd_net [get_bd_pins adc_bit_12/IBUF_OUT] [get_bd_pins adc_inputs/In12]
connect_bd_net [get_bd_pins adc_bit_13/IBUF_OUT] [get_bd_pins adc_inputs/In13]
connect_bd_net [get_bd_pins adc_bit_14/IBUF_OUT] [get_bd_pins adc_inputs/In14]
connect_bd_net [get_bd_pins adc_bit_15/IBUF_OUT] [get_bd_pins adc_inputs/In15]
connect_bd_net [get_bd_pins adc_bit_0/IBUF_OUT] [get_bd_pins adc_inputs/In0]
connect_bd_net [get_bd_pins adc_bit_1/IBUF_OUT] [get_bd_pins adc_inputs/In1]
connect_bd_net -net pulse_in_p2_1 [get_bd_pins pulse_in_p2] [get_bd_pins adc_bit_2/IBUF_DS_P]
connect_bd_net -net pulse_in_n2_1 [get_bd_pins pulse_in_n2] [get_bd_pins adc_bit_2/IBUF_DS_N]
connect_bd_net -net pulse_in_p3_1 [get_bd_pins pulse_in_p3] [get_bd_pins adc_bit_3/IBUF_DS_P]
connect_bd_net -net pulse_in_n3_1 [get_bd_pins pulse_in_n3] [get_bd_pins adc_bit_3/IBUF_DS_N]
connect_bd_net -net pulse_in_p4_1 [get_bd_pins pulse_in_p4] [get_bd_pins adc_bit_4/IBUF_DS_P]
connect_bd_net -net pulse_in_n4_1 [get_bd_pins pulse_in_n4] [get_bd_pins adc_bit_4/IBUF_DS_N]
connect_bd_net -net pulse_in_p5_1 [get_bd_pins pulse_in_p5] [get_bd_pins adc_bit_5/IBUF_DS_P]
connect_bd_net -net pulse_in_n5_1 [get_bd_pins pulse_in_n5] [get_bd_pins adc_bit_5/IBUF_DS_N]
connect_bd_net -net pulse_in_p6_1 [get_bd_pins pulse_in_p6] [get_bd_pins adc_bit_6/IBUF_DS_P]
connect_bd_net -net pulse_in_n6_1 [get_bd_pins pulse_in_n6] [get_bd_pins adc_bit_6/IBUF_DS_N]
connect_bd_net -net pulse_in_p7_1 [get_bd_pins pulse_in_p7] [get_bd_pins adc_bit_7/IBUF_DS_P]
connect_bd_net -net pulse_in_n7_1 [get_bd_pins pulse_in_n7] [get_bd_pins adc_bit_7/IBUF_DS_N]
connect_bd_net -net pulse_in_p8_1 [get_bd_pins pulse_in_p8] [get_bd_pins adc_bit_8/IBUF_DS_P]
connect_bd_net -net pulse_in_n8_1 [get_bd_pins pulse_in_n8] [get_bd_pins adc_bit_8/IBUF_DS_N]
connect_bd_net -net pulse_in_p10_1 [get_bd_pins pulse_in_p10] [get_bd_pins adc_bit_10/IBUF_DS_P]
connect_bd_net -net pulse_in_n10_1 [get_bd_pins pulse_in_n10] [get_bd_pins adc_bit_10/IBUF_DS_N]
connect_bd_net -net pulse_in_p11_1 [get_bd_pins pulse_in_p11] [get_bd_pins adc_bit_11/IBUF_DS_P]
connect_bd_net -net pulse_in_n11_1 [get_bd_pins pulse_in_n11] [get_bd_pins adc_bit_11/IBUF_DS_N]
connect_bd_net -net pulse_in_p9_1 [get_bd_pins pulse_in_p9] [get_bd_pins adc_bit_9/IBUF_DS_P]
connect_bd_net -net pulse_in_n9_1 [get_bd_pins pulse_in_n9] [get_bd_pins adc_bit_9/IBUF_DS_N]
connect_bd_net -net pulse_in_p12_1 [get_bd_pins pulse_in_p12] [get_bd_pins adc_bit_12/IBUF_DS_P]
connect_bd_net -net pulse_in_n12_1 [get_bd_pins pulse_in_n12] [get_bd_pins adc_bit_12/IBUF_DS_N]
connect_bd_net -net pulse_in_p13_1 [get_bd_pins pulse_in_p13] [get_bd_pins adc_bit_13/IBUF_DS_P]
connect_bd_net -net pulse_in_n13_1 [get_bd_pins pulse_in_n13] [get_bd_pins adc_bit_13/IBUF_DS_N]
connect_bd_net -net pulse_in_p14_1 [get_bd_pins pulse_in_p14] [get_bd_pins adc_bit_14/IBUF_DS_P]
connect_bd_net -net pulse_in_n14_1 [get_bd_pins pulse_in_n14] [get_bd_pins adc_bit_14/IBUF_DS_N]
connect_bd_net -net pulse_in_p15_1 [get_bd_pins pulse_in_p15] [get_bd_pins adc_bit_15/IBUF_DS_P]
connect_bd_net -net pulse_in_n15_1 [get_bd_pins pulse_in_n15] [get_bd_pins adc_bit_15/IBUF_DS_N]
connect_bd_net [get_bd_pins pulse_in_p0] [get_bd_pins adc_bit_0/IBUF_DS_P]
connect_bd_net [get_bd_pins pulse_in_n0] [get_bd_pins adc_bit_0/IBUF_DS_N]
connect_bd_net -net pulse_in_p1_1 [get_bd_pins pulse_in_p1] [get_bd_pins adc_bit_1/IBUF_DS_P]
connect_bd_net -net pulse_in_n1_1 [get_bd_pins pulse_in_n1] [get_bd_pins adc_bit_1/IBUF_DS_N]
connect_bd_net [get_bd_pins adc_inputs/dout] [get_bd_pins adc_frontend]

current_bd_instance /ADC_blocks
connect_bd_intf_net [get_bd_intf_pins ADC_BRAM_READ] [get_bd_intf_pins adc_bram_read/S_AXI]
connect_bd_intf_net [get_bd_intf_pins ADC_BRAM_CONTROL] [get_bd_intf_pins adc_bram_control/S_AXI]
connect_bd_intf_net -intf_net axi_bram_ctrl_0_BRAM_PORTA [get_bd_intf_pins adc_bram_read/BRAM_PORTA] [get_bd_intf_pins blk_mem_gen_0/BRAM_PORTB]
connect_bd_net [get_bd_pins clk] \
  [get_bd_pins adc_encoder/clk] [get_bd_pins adc_bram_read/s_axi_aclk] [get_bd_pins blk_mem_gen_0/clka] \
  [get_bd_pins adc_to_bram_0/clk] [get_bd_pins adc_bram_control/s_axi_aclk]
connect_bd_net [get_bd_pins rst_n] \
  [get_bd_pins adc_encoder/rst_n] [get_bd_pins adc_bram_read/s_axi_aresetn] [get_bd_pins adc_to_bram_0/rst_n] \
  [get_bd_pins adc_bram_control/s_axi_aresetn]
connect_bd_net [get_bd_pins adc_frontend] [get_bd_pins adc_encoder/adc_frontend]
connect_bd_net [get_bd_pins adc_encoder/adc_encoded] [get_bd_pins adc_to_bram_0/adc_in]
connect_bd_net [get_bd_pins adc_bram_control/gpio_io_o] [get_bd_pins adc_to_bram_0/axi_gpio_in]
connect_bd_net [get_bd_pins adc_to_bram_0/bram_data] [get_bd_pins blk_mem_gen_0/dina]
connect_bd_net [get_bd_pins adc_to_bram_0/bram_addr] [get_bd_pins blk_mem_gen_0/addra]
connect_bd_net [get_bd_pins adc_to_bram_0/bram_we] [get_bd_pins blk_mem_gen_0/wea]

current_bd_instance /
connect_bd_intf_net [get_bd_intf_pins Processing_Subsystem/M02_AXI_0] [get_bd_intf_pins my_i2c/S_AXI]
connect_bd_intf_net [get_bd_intf_pins Processing_Subsystem/M03_AXI_0] [get_bd_intf_pins dac_calibration/S_AXI1]
connect_bd_intf_net [get_bd_intf_pins Processing_Subsystem/M05_AXI_0] [get_bd_intf_pins bram_tester/S_AXI1]
connect_bd_intf_net [get_bd_intf_pins axi_gpio_leds/S_AXI] [get_bd_intf_pins Processing_Subsystem/M00_AXI_0]
connect_bd_intf_net [get_bd_intf_pins Processing_Subsystem/M04_AXI_0] [get_bd_intf_pins dac_calibration/S_AXI]
connect_bd_intf_net -intf_net Processing_Subsystem_M09_AXI_0 [get_bd_intf_pins Processing_Subsystem/M01_AXI_0] [get_bd_intf_pins dac_calibration/S_AXI_0]
connect_bd_intf_net [get_bd_intf_pins Processing_Subsystem/M09_AXI_0] [get_bd_intf_pins ADC_blocks/ADC_BRAM_CONTROL]
connect_bd_intf_net [get_bd_intf_pins Processing_Subsystem/M07_AXI_0] [get_bd_intf_pins i2c_read/S_AXI]
connect_bd_intf_net [get_bd_intf_pins Processing_Subsystem/M06_AXI_0] [get_bd_intf_pins bram_tester/S_AXI]
connect_bd_intf_net [get_bd_intf_pins Processing_Subsystem/M08_AXI_0] [get_bd_intf_pins ADC_blocks/ADC_BRAM_READ]
connect_bd_net [get_bd_pins Processing_Subsystem/global_clk] \
  [get_bd_pins axi_gpio_leds/s_axi_aclk] [get_bd_pins my_i2c/s_axi_aclk] [get_bd_pins c_counter_binary_0/CLK] \
  [get_bd_pins bram_tester/s_axi_aclk] [get_bd_pins dac_calibration/s_axi_aclk] [get_bd_pins i2c_read/s_axi_aclk] \
  [get_bd_pins i2c_master_0/clk] [get_bd_pins ADC_blocks/clk]
connect_bd_net [get_bd_pins Processing_Subsystem/global_rst_n] \
  [get_bd_pins axi_gpio_leds/s_axi_aresetn] [get_bd_pins my_i2c/s_axi_aresetn] [get_bd_pins bram_tester/s_axi_aresetn] \
  [get_bd_pins dac_calibration/s_axi_aresetn] [get_bd_pins i2c_read/s_axi_aresetn] [get_bd_pins i2c_master_0/rst_n] \
  [get_bd_pins ADC_blocks/rst_n]
connect_bd_net -net axi_gpio_0_gpio_io_o [get_bd_pins axi_gpio_leds/gpio_io_o] [get_bd_pins data_splitter_0/port_in]
connect_bd_net [get_bd_ports pl_clk_p] [get_bd_pins util_ds_buf_0/IBUF_DS_P]
connect_bd_net [get_bd_ports pl_clk_n] [get_bd_pins util_ds_buf_0/IBUF_DS_N]
connect_bd_net [get_bd_pins util_ds_buf_0/IBUF_OUT] [get_bd_pins Processing_Subsystem/clk_in]
connect_bd_net -net sync_in_0_1 [get_bd_ports sync_in] [get_bd_pins dac_calibration/sync_in]
connect_bd_net -net dac_cal_0_counting_flag [get_bd_pins dac_calibration/counting_flag] [get_bd_ports counting_flag]
connect_bd_net [get_bd_pins c_counter_binary_0/Q] [get_bd_pins xlslice_0/Din]
connect_bd_net [get_bd_pins xlslice_0/Dout] [get_bd_ports pl_led0]
connect_bd_net [get_bd_ports pulse_in_p0] [get_bd_pins adc_front_end/pulse_in_p0]
connect_bd_net [get_bd_ports pulse_in_n0] [get_bd_pins adc_front_end/pulse_in_n0]
connect_bd_net -net dac_cal_debug [get_bd_pins dac_calibration/debug] \
  [get_bd_pins xlslice_3/Din] [get_bd_pins xlslice_2/Din] [get_bd_pins xlslice_1/Din]
connect_bd_net -net pulse_in_p1_1 [get_bd_ports pulse_in_p1] [get_bd_pins adc_front_end/pulse_in_p1]
connect_bd_net -net pulse_in_n1_1 [get_bd_ports pulse_in_n1] [get_bd_pins adc_front_end/pulse_in_n1]
connect_bd_net -net pulse_in_p2_1 [get_bd_ports pulse_in_p2] [get_bd_pins adc_front_end/pulse_in_p2]
connect_bd_net -net pulse_in_n2_1 [get_bd_ports pulse_in_n2] [get_bd_pins adc_front_end/pulse_in_n2]
connect_bd_net -net pulse_in_p3_1 [get_bd_ports pulse_in_p3] [get_bd_pins adc_front_end/pulse_in_p3]
connect_bd_net -net pulse_in_n3_1 [get_bd_ports pulse_in_n3] [get_bd_pins adc_front_end/pulse_in_n3]
connect_bd_net [get_bd_pins xlslice_3/Dout] [get_bd_ports debug0]
connect_bd_net [get_bd_pins xlslice_2/Dout] [get_bd_ports debug1]
connect_bd_net [get_bd_pins xlslice_1/Dout] [get_bd_ports debug2]
connect_bd_net -net pulse_in_p4_1 [get_bd_ports pulse_in_p4] [get_bd_pins adc_front_end/pulse_in_p4]
connect_bd_net -net pulse_in_n4_1 [get_bd_ports pulse_in_n4] [get_bd_pins adc_front_end/pulse_in_n4]
connect_bd_net -net pulse_in_p5_1 [get_bd_ports pulse_in_p5] [get_bd_pins adc_front_end/pulse_in_p5]
connect_bd_net -net pulse_in_n5_1 [get_bd_ports pulse_in_n5] [get_bd_pins adc_front_end/pulse_in_n5]
connect_bd_net -net pulse_in_p6_1 [get_bd_ports pulse_in_p6] [get_bd_pins adc_front_end/pulse_in_p6]
connect_bd_net -net pulse_in_n6_1 [get_bd_ports pulse_in_n6] [get_bd_pins adc_front_end/pulse_in_n6]
connect_bd_net -net pulse_in_p7_1 [get_bd_ports pulse_in_p7] [get_bd_pins adc_front_end/pulse_in_p7]
connect_bd_net -net pulse_in_n7_1 [get_bd_ports pulse_in_n7] [get_bd_pins adc_front_end/pulse_in_n7]
connect_bd_net -net pulse_in_p8_1 [get_bd_ports pulse_in_p8] [get_bd_pins adc_front_end/pulse_in_p8]
connect_bd_net -net pulse_in_n8_1 [get_bd_ports pulse_in_n8] [get_bd_pins adc_front_end/pulse_in_n8]
connect_bd_net -net pulse_in_p9_1 [get_bd_ports pulse_in_p9] [get_bd_pins adc_front_end/pulse_in_p9]
connect_bd_net -net pulse_in_n9_1 [get_bd_ports pulse_in_n9] [get_bd_pins adc_front_end/pulse_in_n9]
connect_bd_net -net pulse_in_p10_1 [get_bd_ports pulse_in_p10] [get_bd_pins adc_front_end/pulse_in_p10]
connect_bd_net -net pulse_in_n10_1 [get_bd_ports pulse_in_n10] [get_bd_pins adc_front_end/pulse_in_n10]
connect_bd_net -net pulse_in_p11_1 [get_bd_ports pulse_in_p11] [get_bd_pins adc_front_end/pulse_in_p11]
connect_bd_net -net pulse_in_n11_1 [get_bd_ports pulse_in_n11] [get_bd_pins adc_front_end/pulse_in_n11]
connect_bd_net -net pulse_in_p12_1 [get_bd_ports pulse_in_p12] [get_bd_pins adc_front_end/pulse_in_p12]
connect_bd_net -net pulse_in_n12_1 [get_bd_ports pulse_in_n12] [get_bd_pins adc_front_end/pulse_in_n12]
connect_bd_net -net pulse_in_p13_1 [get_bd_ports pulse_in_p13] [get_bd_pins adc_front_end/pulse_in_p13]
connect_bd_net -net pulse_in_n13_1 [get_bd_ports pulse_in_n13] [get_bd_pins adc_front_end/pulse_in_n13]
connect_bd_net -net pulse_in_p14_1 [get_bd_ports pulse_in_p14] [get_bd_pins adc_front_end/pulse_in_p14]
connect_bd_net -net pulse_in_n14_1 [get_bd_ports pulse_in_n14] [get_bd_pins adc_front_end/pulse_in_n14]
connect_bd_net -net pulse_in_p15_1 [get_bd_ports pulse_in_p15] [get_bd_pins adc_front_end/pulse_in_p15]
connect_bd_net -net pulse_in_n15_1 [get_bd_ports pulse_in_n15] [get_bd_pins adc_front_end/pulse_in_n15]
connect_bd_net [get_bd_pins adc_front_end/adc_frontend] [get_bd_pins dac_calibration/adc_frontend] [get_bd_pins ADC_blocks/adc_frontend]
connect_bd_net [get_bd_pins my_i2c/gpio_io_o] [get_bd_pins i2c_master_0/axi_gpio_in]
connect_bd_net [get_bd_pins i2c_master_0/scl] [get_bd_ports my_i2c_scl]
connect_bd_net [get_bd_ports my_i2c_sda] [get_bd_pins i2c_master_0/sda]
connect_bd_net [get_bd_pins i2c_master_0/axi_gpio_out] [get_bd_pins i2c_read/gpio_io_i]

# ---- address map ----
assign_bd_address -offset 0x40000000 -range 64K -target_address_space [get_bd_addr_spaces Processing_Subsystem/jtag_axi_0/Data] [get_bd_addr_segs i2c_read/S_AXI/Reg]
assign_bd_address -offset 0x80000000 -range 4K -target_address_space [get_bd_addr_spaces Processing_Subsystem/jtag_axi_0/Data] [get_bd_addr_segs axi_gpio_leds/S_AXI/Reg]
assign_bd_address -offset 0x80010000 -range 64K -target_address_space [get_bd_addr_spaces Processing_Subsystem/jtag_axi_0/Data] [get_bd_addr_segs ADC_blocks/adc_bram_control/S_AXI/Reg]
assign_bd_address -offset 0x80020000 -range 64K -target_address_space [get_bd_addr_spaces Processing_Subsystem/jtag_axi_0/Data] [get_bd_addr_segs my_i2c/S_AXI/Reg]
assign_bd_address -offset 0x80030000 -range 64K -target_address_space [get_bd_addr_spaces Processing_Subsystem/jtag_axi_0/Data] [get_bd_addr_segs dac_calibration/dac_cal_control/S_AXI/Reg]
assign_bd_address -offset 0x80040000 -range 64K -target_address_space [get_bd_addr_spaces Processing_Subsystem/jtag_axi_0/Data] [get_bd_addr_segs dac_calibration/dac_cal_read/S_AXI/Reg]
assign_bd_address -offset 0x80050000 -range 128 -target_address_space [get_bd_addr_spaces Processing_Subsystem/jtag_axi_0/Data] [get_bd_addr_segs bram_tester/bram_test_control/S_AXI/Reg]
assign_bd_address -offset 0x82000000 -range 8K -target_address_space [get_bd_addr_spaces Processing_Subsystem/jtag_axi_0/Data] [get_bd_addr_segs bram_tester/axi_bram_ctrl_0/S_AXI/Mem0]
assign_bd_address -offset 0x84000000 -range 256K -target_address_space [get_bd_addr_spaces Processing_Subsystem/jtag_axi_0/Data] [get_bd_addr_segs dac_calibration/dac_bram/S_AXI/Mem0]
assign_bd_address -offset 0x86000000 -range 8K -target_address_space [get_bd_addr_spaces Processing_Subsystem/jtag_axi_0/Data] [get_bd_addr_segs ADC_blocks/adc_bram_read/S_AXI/Mem0]
assign_bd_address -offset 0x0080000000 -range 4K -target_address_space [get_bd_addr_spaces Processing_Subsystem/zynq_ultra_ps_e_0/Data] [get_bd_addr_segs axi_gpio_leds/S_AXI/Reg]
assign_bd_address -offset 0x0080010000 -range 64K -target_address_space [get_bd_addr_spaces Processing_Subsystem/zynq_ultra_ps_e_0/Data] [get_bd_addr_segs ADC_blocks/adc_bram_control/S_AXI/Reg]
assign_bd_address -offset 0x0080020000 -range 64K -target_address_space [get_bd_addr_spaces Processing_Subsystem/zynq_ultra_ps_e_0/Data] [get_bd_addr_segs my_i2c/S_AXI/Reg]
assign_bd_address -offset 0x0080030000 -range 64K -target_address_space [get_bd_addr_spaces Processing_Subsystem/zynq_ultra_ps_e_0/Data] [get_bd_addr_segs dac_calibration/dac_cal_control/S_AXI/Reg]
assign_bd_address -offset 0x0080040000 -range 64K -target_address_space [get_bd_addr_spaces Processing_Subsystem/zynq_ultra_ps_e_0/Data] [get_bd_addr_segs dac_calibration/dac_cal_read/S_AXI/Reg]
assign_bd_address -offset 0x0080050000 -range 64K -target_address_space [get_bd_addr_spaces Processing_Subsystem/zynq_ultra_ps_e_0/Data] [get_bd_addr_segs bram_tester/bram_test_control/S_AXI/Reg]
assign_bd_address -offset 0x0082000000 -range 8K -target_address_space [get_bd_addr_spaces Processing_Subsystem/zynq_ultra_ps_e_0/Data] [get_bd_addr_segs bram_tester/axi_bram_ctrl_0/S_AXI/Mem0]
assign_bd_address -offset 0x0084000000 -range 8K -target_address_space [get_bd_addr_spaces Processing_Subsystem/zynq_ultra_ps_e_0/Data] [get_bd_addr_segs dac_calibration/dac_bram/S_AXI/Mem0]
assign_bd_address -offset 0x0086000000 -range 8K -target_address_space [get_bd_addr_spaces Processing_Subsystem/zynq_ultra_ps_e_0/Data] [get_bd_addr_segs ADC_blocks/adc_bram_read/S_AXI/Mem0]

validate_bd_design
save_bd_design
